# EAGLE design Qwiic_OLED_Breakout_NO_T (EAGLE 7.6.0)
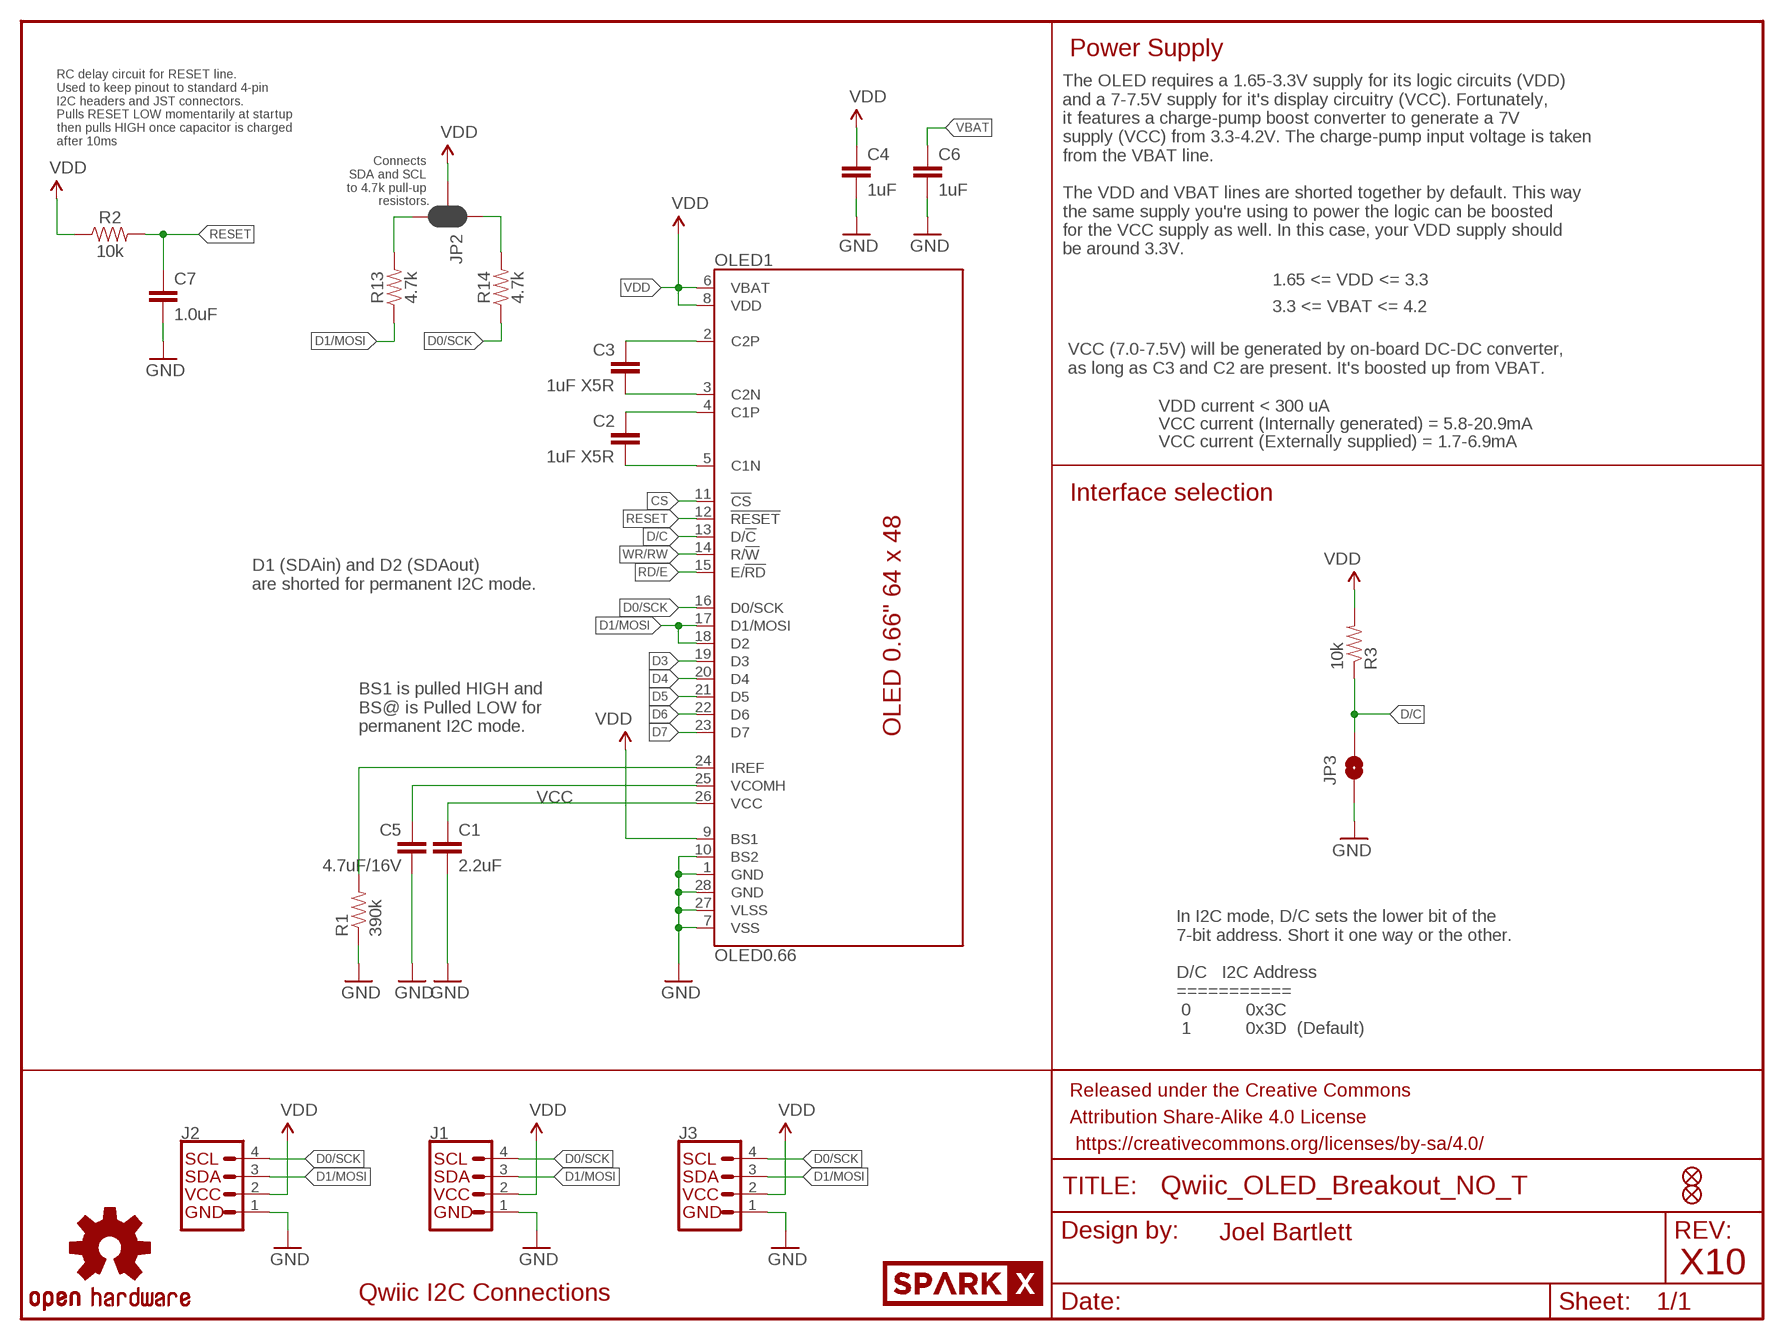
[diagram p0: schematic, sheet 1]

## Parts
C1  2.2uF  CAP0805  [0805]
C2  1uF X5R  CAP0805  [0805]
C3  1uF X5R  CAP0805  [0805]
C4  1uF  CAP0603-CAP  [0603-CAP]
C5  4.7uF/16V  CAP1206  [1206]
C6  1uF  CAP0603-CAP  [0603-CAP]
C7  1.0uF  1.0UF-0603-16V-10%  [0603]
FID1  FIDUCIAL1X2  [FIDUCIAL-1X2]
FID2  FIDUCIAL1X2  [FIDUCIAL-1X2]
FRAME1  FRAME-LETTER  [CREATIVE_COMMONS]
J1  I2C_STANDARDJS-1MM  [1X04_1MM_RA]
J2  I2C_STANDARDJS-1MM  [1X04_1MM_RA]
J3  I2C_STANDARD_NO_SILK  [1X04_NO_SILK]
JP2  JUMPER-SMT_3_2-NC_PASTE_SILK  [SMT-JUMPER_3_2-NC_PASTE_SILK]
JP3  JUMPER-SMT_2_NO_SILK  [SMT-JUMPER_2_NO_SILK]
LOGO3  OSHW-LOGOS  [OSHW-LOGO-S]
OLED1  OLED0.66  [OLED-0.66-64X48]
R1  390k  RESISTOR0603-RES  [0603-RES]
R2  10k  10KOHM-0603-1/10W-1%  [0603]
R3  10k  RESISTOR0603-RES  [0603-RES]
R13  4.7k  4.7KOHM-0603-1/10W-1%  [0603]
R14  4.7k  4.7KOHM-0603-1/10W-1%  [0603]
U$3  SPARKX-LOGO2  [SPARKX-TINY]

## Nets
C1N: C2.2 OLED1.5(C1N)
C1P: C2.1 OLED1.4(C1P)
C2N: C3.2 OLED1.3(C2N)
C2P: C3.1 OLED1.2(C2P)
CS: OLED1.11(!CS!)
D0/SCK: J1.4(SCL) J2.4(SCL) J3.4(SCL) OLED1.16(D0/SCK) R14.1
D1/MOSI: J1.3(SDA) J2.3(SDA) J3.3(SDA) OLED1.17(D1/MOSI) OLED1.18(D2) R13.1
D3: OLED1.19(D3)
D4: OLED1.20(D4)
D5: OLED1.21(D5)
D6: OLED1.22(D6)
D7: OLED1.23(D7)
D/C: JP3.2 OLED1.13(D/!C!) R3.1
GND: C1.2 C4.2 C5.2 C6.2 C7.2 J1.1(GND) J2.1(GND) J3.1(GND) JP3.1 OLED1.1(GND) OLED1.7(VSS) OLED1.10(BS2) OLED1.27(VLSS) OLED1.28(GND) R1.1
IREF: OLED1.24(IREF) R1.2
N$4: JP2.3 R13.2
N$5: JP2.1 R14.2
RD/E: OLED1.15(E/!RD!)
RESET: C7.1 OLED1.12(!RESET!) R2.2
VBAT: C6.1
VCC: C1.1 OLED1.26(VCC)
VCOMH: C5.1 OLED1.25(VCOMH)
VDD: C4.1 J1.2(VCC) J2.2(VCC) J3.2(VCC) JP2.2 OLED1.6(VBAT) OLED1.8(VDD) OLED1.9(BS1) R2.1 R3.2
WR/RW: OLED1.14(R/!W!)

## Notes on the sheet
- Power Supply
- The OLED requires a 1.65-3.3V supply for its logic circuits (VDD) 
  and a 7-7.5V supply for it's display circuitry (VCC). Fortunately, 
  it features a charge-pump boost converter to generate a 7V 
  supply (VCC) from 3.3-4.2V. The charge-pump input voltage is taken 
  from the VBAT line.
  
  The VDD and VBAT lines are shorted together by default. This way
  the same supply you're using to power the logic can be boosted 
  for the VCC supply as well. In this case, your VDD supply should 
  be around 3.3V.
- RC delay circuit for RESET line. 
  Used to keep pinout to standard 4-pin
  I2C headers and JST connectors. 
  Pulls RESET LOW momentarily at startup
  then pulls HIGH once capacitor is charged
  after 10ms
- Connects 
  SDA and SCL 
  to 4.7k pull-up 
  resistors.
- 1.65 <= VDD <= 3.3
- 3.3 <= VBAT <= 4.2
- VCC (7.0-7.5V) will be generated by on-board DC-DC converter, 
  as long as C3 and C2 are present. It's boosted up from VBAT.
- VDD current < 300 uA
- VCC current (Internally generated) = 5.8-20.9mA
- VCC current (Externally supplied) = 1.7-6.9mA
- Interface selection
- D1 (SDAin) and D2 (SDAout)
  are shorted for permanent I2C mode.
- BS1 is pulled HIGH and 
  BS@ is Pulled LOW for 
  permanent I2C mode.
- In I2C mode, D/C sets the lower bit of the 
  7-bit address. Short it one way or the other.
  
  D/C   I2C Address
  ===========
   0           0x3C
   1           0x3D  (Default)
- Joel Bartlett
- X10
- Qwiic I2C Connections

## Library data of the parts
C1-C6 = SparkFun-Passives:CAP: Capacitor Standard 0603 ceramic capacitor, and 0.1" leaded capacitor.
C7 = SparkFun-Capacitors:1.0UF: 1µF ceramic capacitors A capacitor is a passive two-terminal electrical component used to store electrical energy temporarily in an electric field.; PROD_ID: CAP-00868
FID1 FID2 = SparkFun-Aesthetics:FIDUCIAL: Fiducial Alignment Points Various fiducial points for machine vision alignment.
FRAME1 = SparkFun-Aesthetics:FRAME-LETTER: Schematic Frame Standard 8.5x11 US Letter frame
J1-J3 = SparkX:I2C_STANDARD: SparkFun I2C Standard Pinout Header SparkFun has standardized on a pinout for all I2C based sensor breakouts. This pinout allows I2C boards to be plugged directly into the headers on Arduino Uno compatible boards, and to be daisy chained easily. Example SparkFun Products: SparkFun Atmospheric Sensor Breakout - BME280 <https://www.sparkfun.com/products/13676> SparkFun Altitude/Pressure Sensor Breakout - MPL3115A2 <https://www.sparkfun.com/products/11084> SparkFun TOF Range Finder Sensor - VL6180 <https://www.sparkfun.com/products/12785>
JP2 = SparkFun-Jumpers:JUMPER-SMT_3_2-NC_PASTE: Normally closed solder jumper (2 of 2 connections) This jumper has an aperture in the stencil to allow solder paste to bridge both connections. Both connections are normally closed (NC). Wick off the solder to open the connection(s). Reapply solder to reclose the connection(s).
JP3 = SparkFun-Jumpers:JUMPER-SMT_2_NO: Normally open jumper This jumper has two pads in close proximity to each other. Apply solder to close the connection. Round pads are easier to solder for beginners, but are a lot larger. SparkFun Product that uses the round pads: SparkFun EL Sequencer <https://www.sparkfun.com/products/12781>
LOGO3 = SparkFun-Aesthetics:OSHW-LOGO: Open Source Hardware Logo This logo indicates the piece of hardware it is found on incorporates a OSHW license and/or adheres to the definition of open source hardware found here: http://freedomdefined.org/OSHW
OLED1 = microView-temp:OLED0.66
R1 R3 = SparkFun-Passives:RESISTOR: Resistor Basic schematic elements and footprints for 0603, 1206, and PTH resistors.
R2 = SparkFun-Resistors:10KOHM: 10kΩ resistor A resistor is a passive two-terminal electrical component that implements electrical resistance as a circuit element. Resistors act to reduce current flow, and, at the same time, act to lower voltage levels within circuits. - Wikipedia; PROD_ID: RES-00824
R13 R14 = SparkFun-Resistors:4.7KOHM: 4.7kΩ resistor A resistor is a passive two-terminal electrical component that implements electrical resistance as a circuit element. Resistors act to reduce current flow, and, at the same time, act to lower voltage levels within circuits. - Wikipedia; PROD_ID: RES-07857
U$3 = SparkX:SPARKX-LOGO

## Board
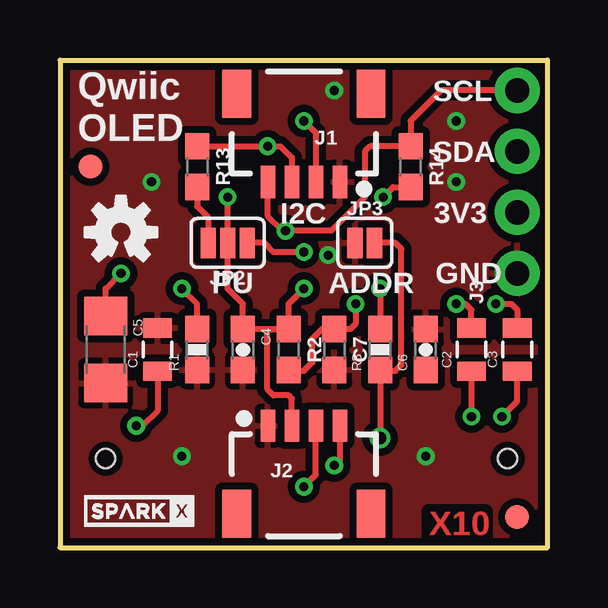
[diagram p1: board, top side]
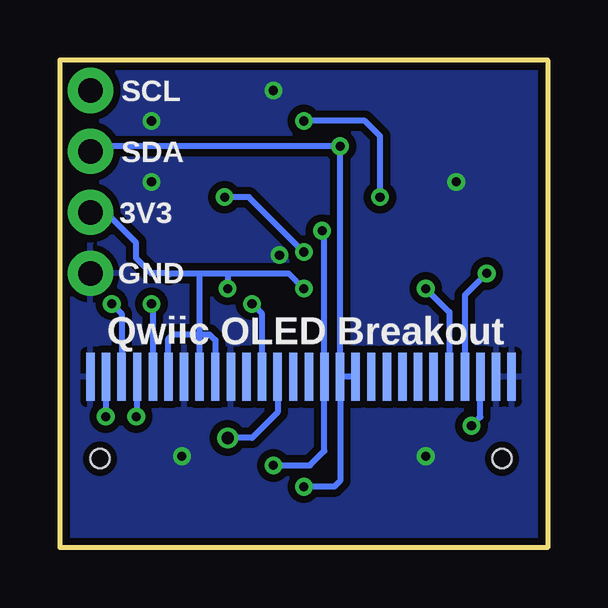
[diagram p2: board, bottom side, seen from below]

Size 20.32 x 20.32 mm. Coordinates in mm from the lower left corner, seen from the top.
Outline: 20.32,0 20.32,20.32 0,20.32 0,0 20.32,0
Copper layers (1*16): Top 0.035mm / dielectric 1.5mm / Bottom 0.035mm
Design rules "SparkFun-2-layer-TIGHT": minimum track width 7mil, minimum drill 15mil, track to track 7mil, track to pad 7mil, pad to pad 7mil, via to via 7mil, smd to smd 7mil, copper to edge 7mil, drill to drill 7mil, minimum pad ring 7mil, minimum via ring 7mil, stop-mask expansion 4mil, vias tented up to drill 25mil, thermal gap 10mil
Milling: area 6.2,25.1 to 14.2,27.1; area 12.2,27.1 to 14.2,29.1

### Footprints (pad centres in the part's own frame; a part is rotated, then mirrored left to right if it is on the bottom)
0805 = smd 0.8 x 1.2: 1 -0.9,0; 2 0.9,0
0603-CAP = smd 1.1 x 1: 1 -0.85,0; 2 0.85,0
1206 = smd 1.6 x 1.8: 1 -1.4,0; 2 1.4,0
0603 = smd 1.1 x 1: 1 -0.85,0; 2 0.85,0
FIDUCIAL-1X2 = smd 1 x 1: 1 0,0
1X04_1MM_RA = smd 0.6 x 1.35: 1 -1.5,0; 2 -0.5,0; 3 0.5,0; 4 1.5,0 | smd 1.2 x 2: NC1 2.8,-3.675; NC2 -2.8,-3.675
1X04_NO_SILK = drill 1.016 pad 1.88: 1 0,0; 2 2.54,0; 3 5.08,0; 4 7.62,0
SMT-JUMPER_3_2-NC_PASTE_SILK = smd 0.635 x 1.27: 1 -0.813,0; 2 0,0; 3 0.813,0
SMT-JUMPER_2_NO_SILK = smd 0.635 x 1.27: 1 -0.406,0; 2 0.406,0
OLED-0.66-64X48 = smd 0.35 x 2: 1 0,0; 2 0.65,0; 3 1.3,0; 4 1.95,0; 5 2.6,0; 6 3.25,0; 7 3.9,0; 8 4.55,0; 9 5.2,0; 10 5.85,0; 11 6.5,0; 12 7.15,0; 13 7.8,0; 14 8.45,0; 15 9.1,0; 16 9.75,0; 17 10.4,0; 18 11.05,0; 19 11.7,0; 20 12.35,0; 21 13,0; 22 13.65,0; 23 14.3,0; 24 14.95,0; 25 15.6,0; 26 16.25,0; 27 16.9,0; 28 17.55,0 | hole 0.8: 17.15,-3.4; 0.4,-3.4
0603-RES = smd 1.1 x 1: 1 -0.85,0; 2 0.85,0

### Placement (x,y rotation side)
C1  4.06,8.26 90 top
C2  17.14,8.26 90 top
C3  19.05,8.26 90 top
C4  7.62,8.26 270 top
C5  1.91,8.26 270 top
C6  15.24,8.26 90 top
C7  11.43,8.26 270 top
FID1  19.05,1.27 0 top
FID2  1.27,15.88 0 top
FRAME1  17.78,-19.05 0 bottom  (outside the outline)
J1  10.16,15.24 180 top
J2  10.16,5.08 0 top
J3  19.05,11.43 90 top
JP2  6.99,12.7 180 top
JP3  12.7,12.7 0 top
LOGO3  2.54,13.14 0 top
OLED1  19.05,7.11 0 bottom
R1  5.71,8.26 90 top
R2  9.53,8.26 270 top
R3  13.34,8.26 90 top
R13  5.71,15.88 270 top
R14  14.61,15.88 270 top
U$3  3.3,1.52 0 top

### Tracks (layer width: path | path; a pad name or v marks a point on that pad's centre or on a via)
C1N  (via drill 0.38)
  Top 0.254: C2.2 17.14,9.91 16.89,10.16 v16.51,10.16
  Bottom 0.254: v16.51,10.16 16.45,10.1 OLED1.5
C1P  (via drill 0.38)
  Top 0.254: C2.1 v17.14,5.46
  Bottom 0.254: v17.14,5.46 17.1,5.51 OLED1.4
C2N  (via drill 0.38)
  Top 0.254: 19.05,9.53 C3.2 19.05,9.91 18.8,10.16 v18.16,10.16
  Bottom 0.254: OLED1.3 17.75,9.75 v18.16,10.16
C2P  (via drill 0.38)
  Top 0.254: v18.41,5.46 19.05,6.1 C3.1
  Bottom 0.254: v18.41,5.46 18.4,5.48 OLED1.2
D0/SCK  (via drill 0.38)
  Top 0.254: J2.4 11.66,3.66 v11.43,3.43 | J3.4 15.88,19.05 14.61,17.78 R14.1 12.91,16.73 12.7,16.51 12.7,14.61 11.3,13.21 v9.4,13.21 9.27,13.21 8.66,13.82 J1.4
  Bottom 0.254: v11.43,3.43 9.91,3.43 9.3,4.04 OLED1.16 9.3,13.11 v9.4,13.21
D1/MOSI  (via drill 0.38)
  Top 0.254: v10.16,2.54 10.66,3.04 J2.3 | R13.1 v8.65,16.73 9.18,16.73 9.66,16.25 J1.3
  Bottom 0.254: OLED1.18 OLED1.17 | OLED1.17 8.65,2.78 8.89,2.54 v10.16,2.54 | OLED1.17 v8.65,16.73 18.84,16.73 J3.3
D/C  (via drill 0.51)
  Top 0.254: R3.1 13.37,7.37 | 13.37,7.37 13.97,7.37 14.22,7.62 14.22,12.45 13.97,12.7 JP3.2 | 13.37,7.37 13.34,7.33 v13.34,4.57
  Bottom 0.254: OLED1.13 11.25,5.64 12.32,4.57 v13.34,4.57
GND  (via drill 0.38)
  other vias: 5.08,3.81 11.18,12.19 16.51,15.24 11.43,19.05 16.51,17.78 15.24,3.81 3.81,15.24
  pour Bottom (isolate 0.305): 20.32,0 20.32,20.32 0,20.32 0,0
  pour Top (isolate 0.305): 20.32,0 20.32,20.32 0,20.32 0,0
IREF  (via drill 0.38)
  Top 0.254: R1.2 5.71,10.16 v5.08,10.79
  Bottom 0.254: v5.08,10.79 4.1,9.81 OLED1.24
N$4
  Top 0.254: R13.2 5.71,14.22 6.17,13.77 JP2.3
N$5  (via drill 0.38)
  Top 0.254: 14.39,15.03 R14.2 13.88,15.03 v13.46,14.61 | v10.16,12.32 8.89,12.32 8.51,12.7 JP2.1
  Bottom 0.254: v10.16,12.32 12.45,14.61 v13.46,14.61
RESET  (via drill 0.38)
  Top 0.254: R2.2 9.56,7.37 10.16,7.37 10.52,7.72 10.52,8.71 10.91,9.11 C7.1 12.1,9.11 12.32,9.32 v12.32,10.16
  Bottom 0.254: OLED1.12 11.9,9.74 v12.32,10.16
VCC  (via drill 0.38)
  Top 0.254: C1.1 4.06,5.71 3.43,5.08 v3.17,5.08
  Bottom 0.254: v3.17,5.08 2.8,5.46 OLED1.26
VCOMH  (via drill 0.38)
  Top 0.254: C5.1 1.91,10.79 v2.54,11.43
  Bottom 0.254: v2.54,11.43 3.45,10.52 OLED1.25
VDD  (via drill 0.38)
  Top 0.254: J2.2 9.66,6.21 9.53,6.35 8.89,6.35 8.64,6.6 8.64,9.11 R2.1 | R2.1 C4.1 7.62,10.16 6.99,10.79 JP2.2 v6.99,14.61 | v13.34,10.79 R3.2 | v10.16,17.78 10.66,17.28 J1.2 | R2.1 9.53,10.16 v10.16,10.79
  Bottom 0.254: 14.5,8.89 14.5,11.32 14.61,11.43 | v6.99,14.61 6.99,17.14 7.62,17.78 v10.16,17.78 | 13.34,11.43 v13.34,10.79 | 15.88,11.43 14.61,11.43 | 14.61,11.43 13.34,11.43 | 15.8,11.36 15.88,11.43 | J3.2 18.41,13.97 17.14,12.7 17.14,12.06 16.51,11.43 15.88,11.43 | 13.34,11.43 10.79,11.43 v10.16,10.79 | OLED1.8 14.5,8.89 | 14.5,8.89 14.1,8.89 13.85,8.64 OLED1.9 | OLED1.6 15.8,8.71 15.62,8.89 14.5,8.89

### Text on the board
Top: X10
tPlace: SCL | Qwiic / OLED | SDA | 3V3 | I2C | PU | ADDR | GND
bPlace: SCL | SDA | 3V3 | GND | Qwiic OLED Breakout